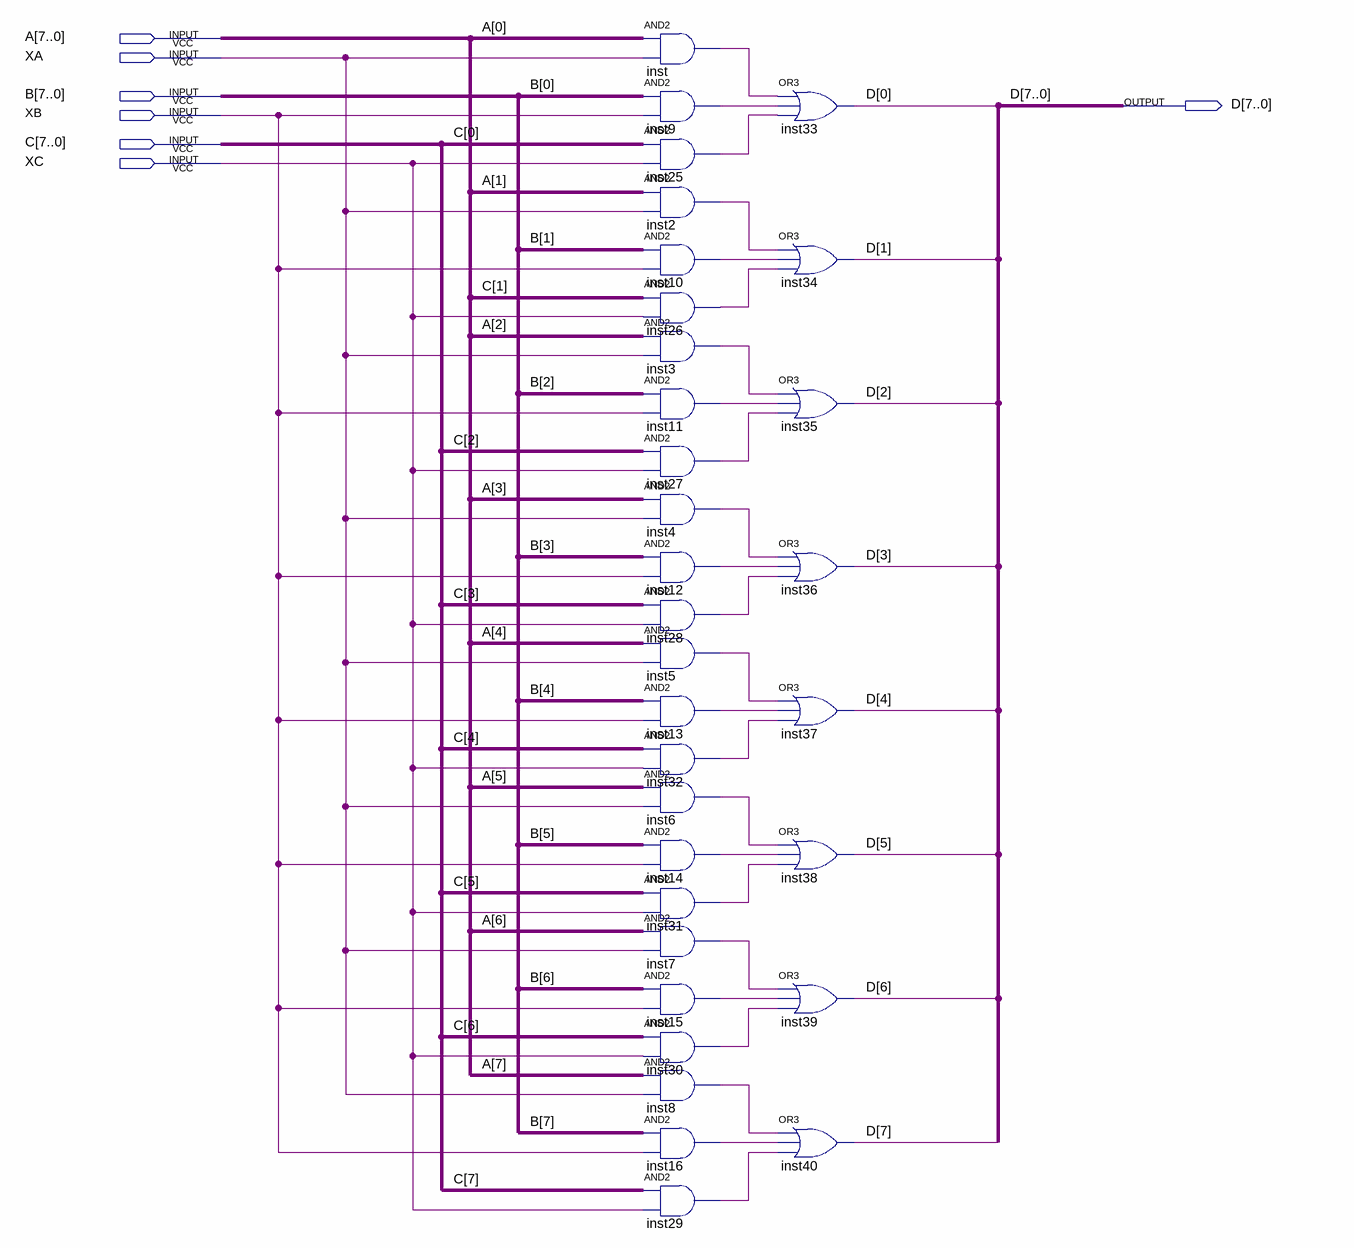
[diagram p0: schematic sheet]
// Quartus schematic SEL.bdf as structural Verilog: 32 symbols, 7 pins
module SEL (
  input  [7:0] A,
  input  XA,
  input  [7:0] B,
  input  XB,
  input  [7:0] C,
  input  XC,
  output [7:0] D
);

  wire inst2_out, inst3_out, inst4_out, inst5_out, inst6_out, inst7_out, inst8_out, inst9_out, inst10_out,
       inst11_out, inst12_out, inst13_out, inst14_out, inst15_out, inst16_out, inst25_out, inst26_out,
       inst27_out, inst28_out, inst29_out, inst30_out, inst31_out, inst32_out, inst_out;

  and inst (inst_out, A[0], XA);
  and inst9 (inst9_out, B[0], XB);
  and inst25 (inst25_out, C[0], XC);
  and inst2 (inst2_out, A[1], XA);
  and inst10 (inst10_out, B[1], XB);
  and inst26 (inst26_out, C[1], XC);
  and inst3 (inst3_out, A[2], XA);
  and inst11 (inst11_out, B[2], XB);
  and inst27 (inst27_out, C[2], XC);
  and inst4 (inst4_out, A[3], XA);
  and inst12 (inst12_out, B[3], XB);
  and inst28 (inst28_out, C[3], XC);
  and inst5 (inst5_out, A[4], XA);
  and inst13 (inst13_out, B[4], XB);
  and inst32 (inst32_out, C[4], XC);
  and inst6 (inst6_out, A[5], XA);
  and inst14 (inst14_out, B[5], XB);
  and inst31 (inst31_out, C[5], XC);
  and inst7 (inst7_out, A[6], XA);
  and inst15 (inst15_out, B[6], XB);
  and inst30 (inst30_out, C[6], XC);
  and inst8 (inst8_out, A[7], XA);
  and inst16 (inst16_out, B[7], XB);
  and inst29 (inst29_out, C[7], XC);
  or inst33 (D[0], inst_out, inst9_out, inst25_out);
  or inst34 (D[1], inst2_out, inst10_out, inst26_out);
  or inst35 (D[2], inst3_out, inst11_out, inst27_out);
  or inst36 (D[3], inst4_out, inst12_out, inst28_out);
  or inst37 (D[4], inst5_out, inst13_out, inst32_out);
  or inst38 (D[5], inst6_out, inst14_out, inst31_out);
  or inst39 (D[6], inst7_out, inst15_out, inst30_out);
  or inst40 (D[7], inst8_out, inst16_out, inst29_out);
endmodule
